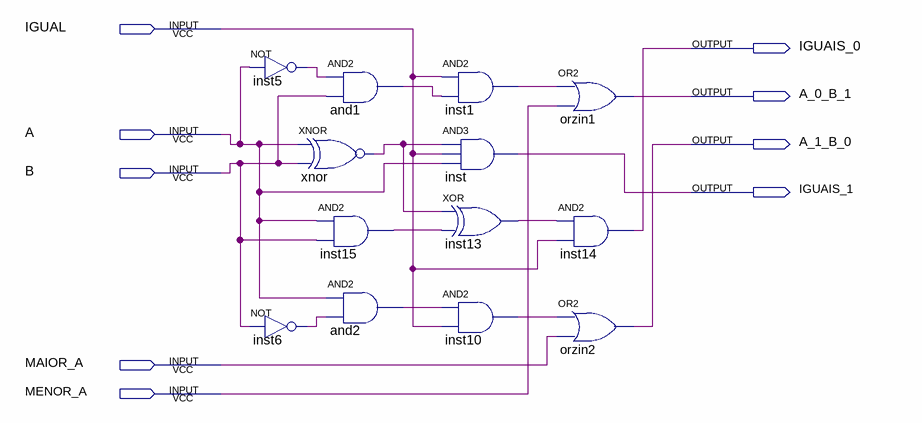
[diagram p0: schematic sheet]
// Quartus schematic comparadorSinal.bdf as structural Verilog: 13 symbols, 9 pins
module comparadorSinal (
  input  IGUAL,
  input  A,
  input  B,
  input  MAIOR_A,
  input  MENOR_A,
  output IGUAIS_0,
  output A_0_B_1,
  output A_1_B_0,
  output IGUAIS_1
);

  wire and1_out, and2_out, inst1_out, inst5_out, inst6_out, inst10_out, inst13_out, inst15_out, xnor_out;

  not inst5 (inst5_out, A);
  not inst6 (inst6_out, B);
  and and1 (and1_out, inst5_out, B);
  xnor \xnor  (xnor_out, A, B);
  and inst15 (inst15_out, A, B);
  and and2 (and2_out, A, inst6_out);
  and inst1 (inst1_out, IGUAL, and1_out);
  and inst (IGUAIS_1, xnor_out, IGUAL, A);
  xor inst13 (inst13_out, xnor_out, inst15_out);
  and inst10 (inst10_out, and2_out, IGUAL);
  or orzin1 (A_0_B_1, inst1_out, MENOR_A);
  and inst14 (IGUAIS_0, inst13_out, IGUAL);
  or orzin2 (A_1_B_0, inst10_out, MAIOR_A);
endmodule
